# EasyEDA Pro project ProPrj_ESP32-S3-ai-chatbot_2025-01-20.epro

# Schematic Schematic1
Board Name: Board1; Create Date: 2025-01-11; Page Name: P1; Project Name: esp32-s3-wroom-1拓展版; Schematic Name: Schematic1; Update Date: 2025-01-20; Company: 嘉立创EDA; Page Size: A3; Version: V1.0
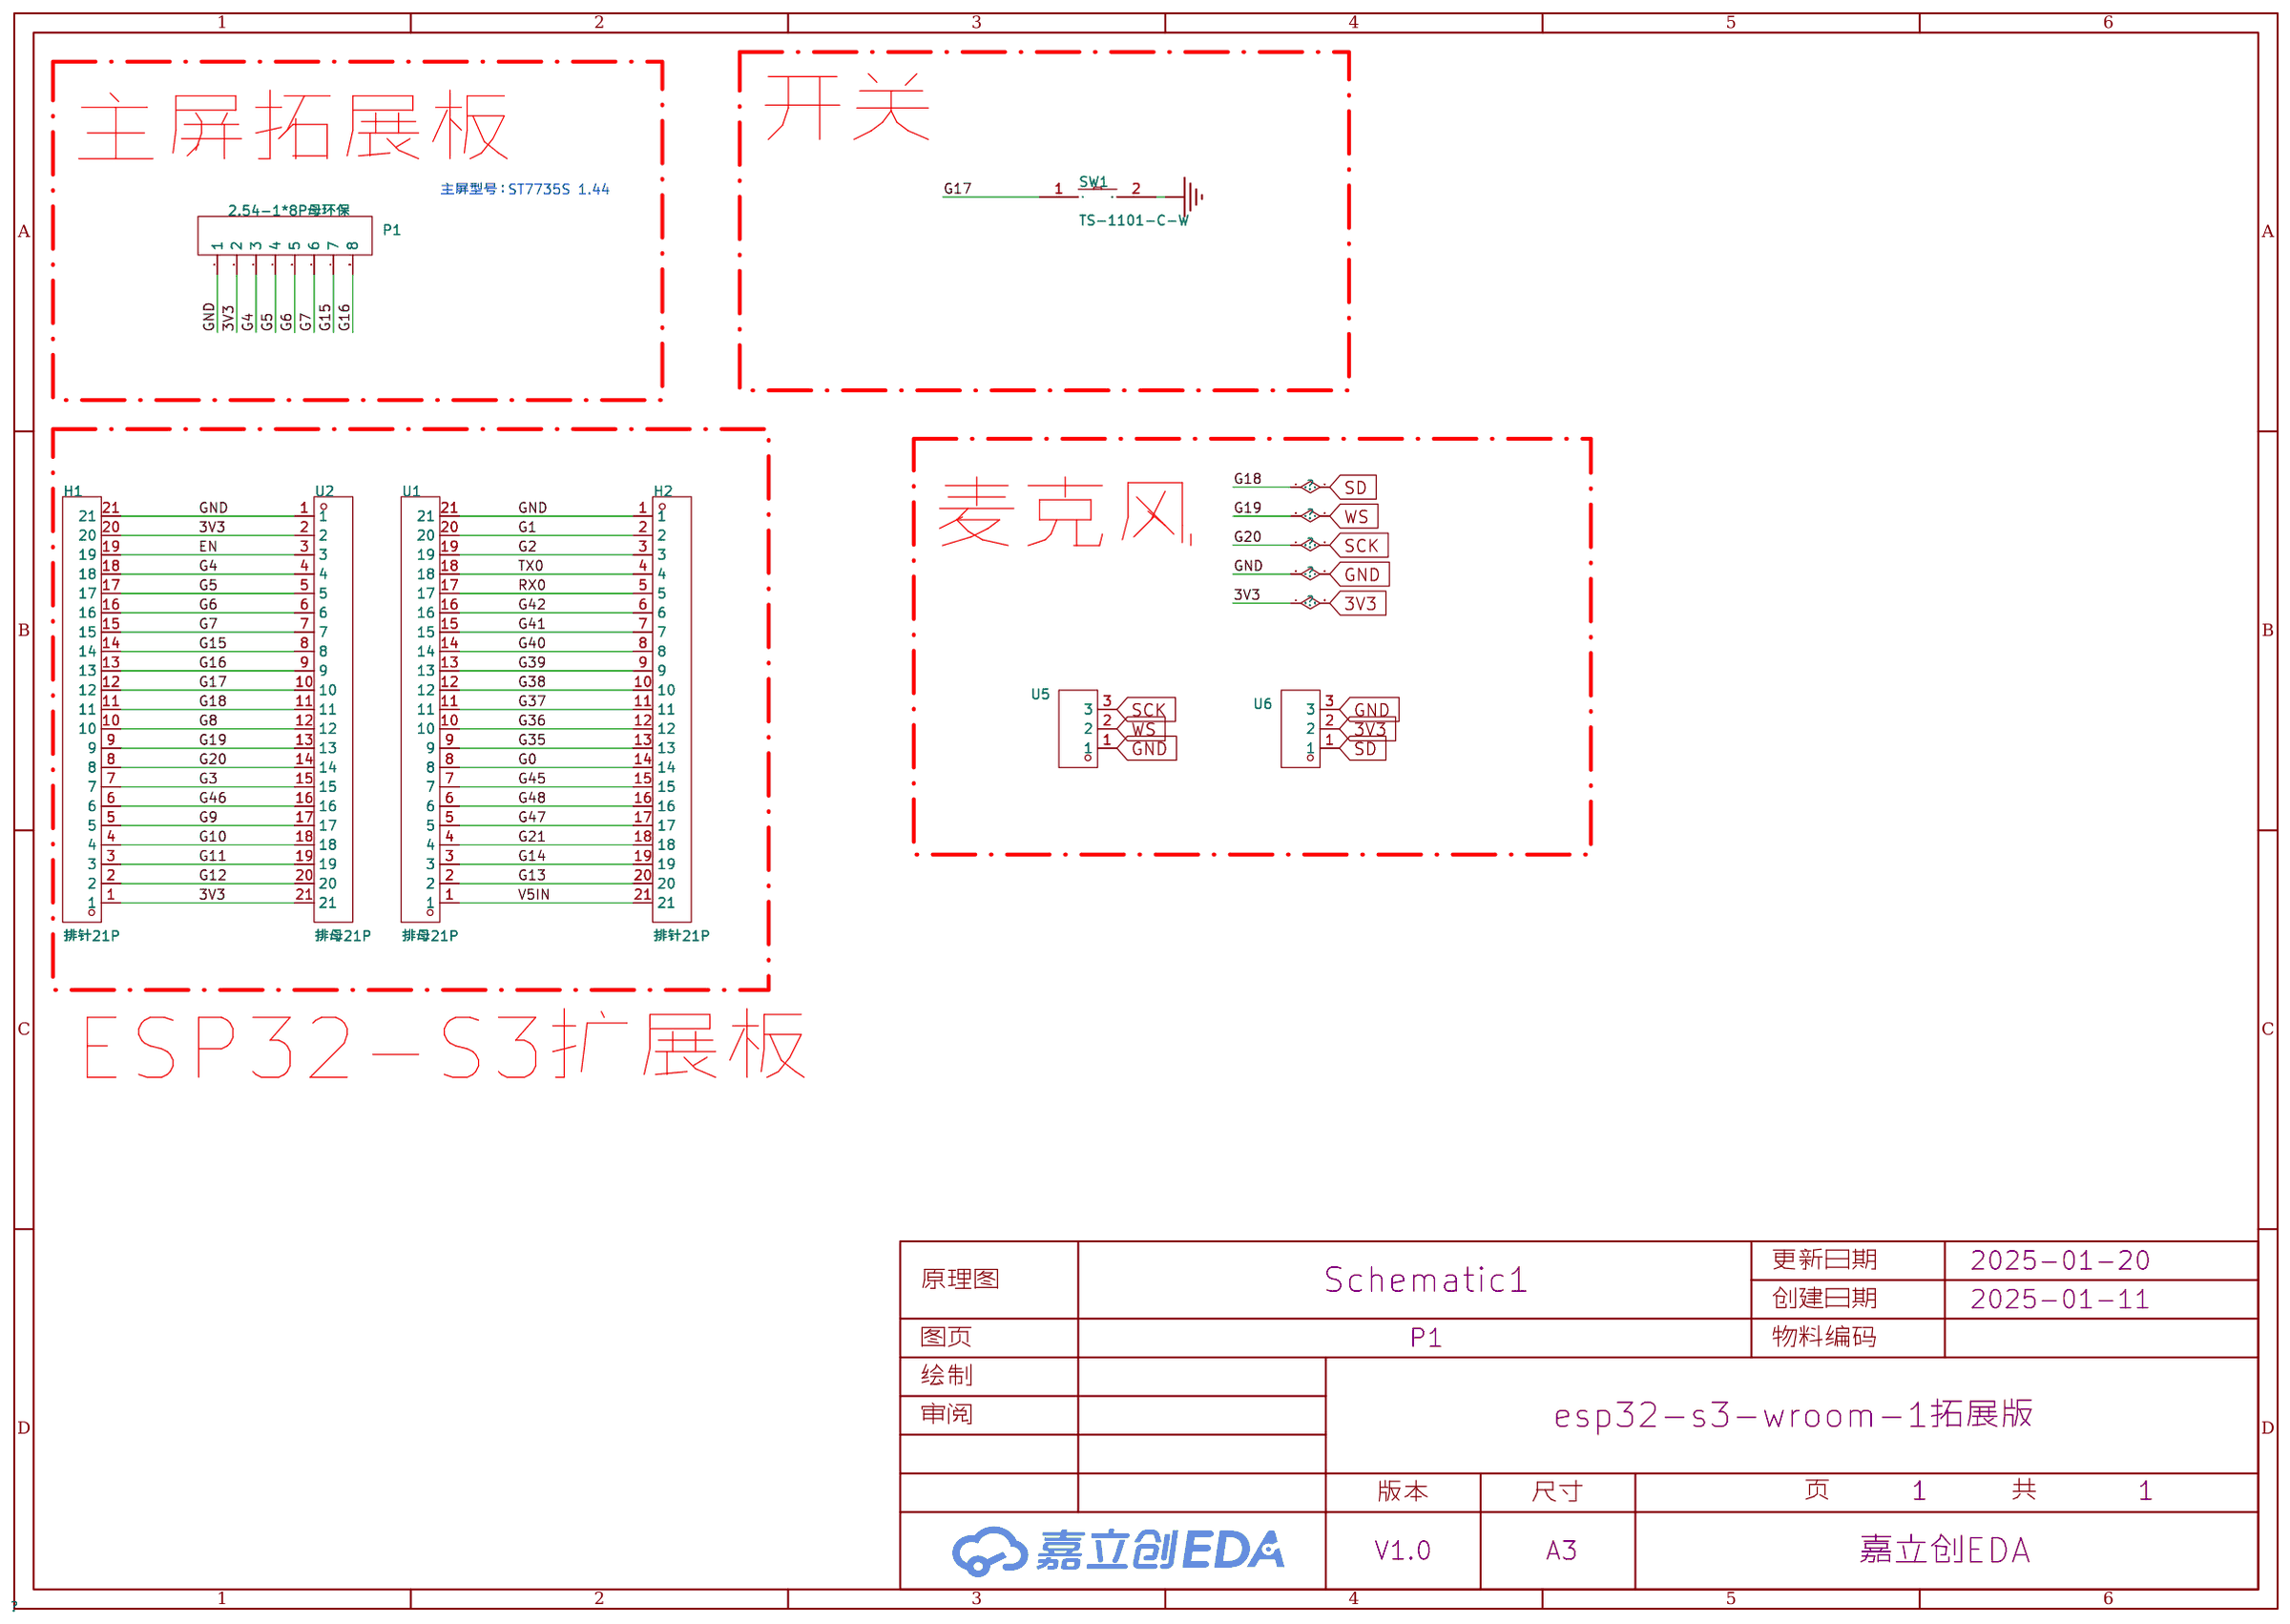
[diagram p0: schematic sheet]

## Parts
H1  排针21P  [HDR-TH_21P-P2.54-V-M]
H2  排针21P  [HDR-TH_21P-P2.54-V-M]
P1  2.54-1*8P母环保  [HDR-TH_8P-P2.54-V-F-1]
SW1  TS-1101-C-W  [SW-SMD_L6.0-W3.3-LS8.0]
U1  排母21P  [HDR-TH_21P-P2.54-V-F]
U2  排母21P  [HDR-TH_21P-P2.54-V-F]
U5  排母2.54mm 1X3pin  [HDR-TH_3P-P2.54_CS-1165SDIG]
U6  排母2.54mm 1X3pin  [HDR-TH_3P-P2.54_CS-1165SDIG]

## Library data of the parts
H1 H2 = X6511WV-21H-C60D30: 插针结构:1x21P;间距:2.54mm;行距:2.54mm;圆针/方针:方针;安装类型:-;排数:单排;总PIN位数:21P;额定电流:3A;额定电压:250V;配合针长度:-;塑高:2.5mm;端接针长度:-;触头材质:黄铜;触头镀层:金;工作温度范围:-40℃~+105℃;焊接温度(最大值):260℃;颜色:黑色;; LCSC Part Name: 1x21P 间距:2.54mm 方针; Supplier Part: C725953; Manufacturer: XKB Connection(中国星坤); Supplier Footprint: 插件,P=2.54mm; JLCPCB Part Class: 扩展库; Supplier: LCSC; Pin Structure: 1x21P; Pitch: 2.54mm; Row Spacing: 2.54mm; Circluar Pins/Square Pins: 方针; Number of Rows: 单排; Number of Pins: 21P; Current Rating (Max): 3A; Voltage Rating (Max): 250V; Insulation Height: 2.5mm; Contact Material: 黄铜; Contact Plating: 金; Operating Temperature Range: -40℃~+105℃; Soldering Temperature(Max): 260℃; Color: 黑色
P1 = 2.54-1*8P母环保: 插孔结构:1x8P;间距:2.54mm;行距:-;安装类型:直插;排数:单排;总孔位数:8P;塑高:-;触头材质:-;触头镀层:-;; LCSC Part Name: 间距:2.54mm 1x8P 直插; Supplier Part: C27438; Manufacturer: BOOMELE(博穆精密); Supplier Footprint: 插件,P=2.54mm; JLCPCB Part Class: 扩展库; Datasheet: https://atta.szlcsc.com/upload/public/pdf/source/20231221/1CA800C6799ED97958773716FAA1BFFE.pdf; Supplier: LCSC; Holes Structure: 1x8P; Pitch: 2.54mm; Mounting Type: 直插; Number of Rows: 单排; Number of Holes: 8P
SW1 = TS-1101-C-W: 电路结构:单刀单掷;按钮形状:矩形按钮;作用力:260gf;安装方式:立贴;开关长度:6mm;开关宽度:3.6mm;开关高度:2.5mm;带支架:不带;触点电流:50mA;额定电压(AC):-;额定电压(DC):12V;额定功率:-;绝缘电阻:-;带灯:无;机械寿命:5万次;; LCSC Part Name: 6*3.6*2.5mm 立贴 轻触开关; Supplier Part: C318938; Manufacturer: XKB Connectivity(中国星坤); Supplier Footprint: SMD; JLCPCB Part Class: 扩展库; Datasheet: https://atta.szlcsc.com/upload/public/pdf/source/20200227/C318938_C2E53B1EEDE37D980A33616AC086DE53.pdf; Supplier: LCSC; Circuit: 单刀单掷; Actuator Style: 矩形按钮; Operating Force: 260gf; Mounting Style: 立贴; Switch Length: 6mm; Switch Width: 3.6mm; Switch Height: 2.5mm; Strike Gundam: 不带; Contact Current: 50mA; Voltage Rating (DC): 12V; Actuator/Cap Color: 白色带淡绿; With Lamp: 无; Mechanical Life: 5万次; Operating Temperature: -30℃~+85℃
U1 U2 = X6511FV-21-C85D32: 插孔结构:1x21P;间距:2.54mm;行距:-;圆孔/方孔:方孔;安装类型:直插;排数:单排;总孔位数:21P;额定电流:3A;额定电压:250V;插孔方向:顶部;塑高:8.5mm;触头材质:黄铜;触头镀层:金;工作温度范围:-40℃~+105℃;焊接温度(最大值):260℃;; LCSC Part Name: 间距:2.54mm 1x21P 直插; Supplier Part: C2883738; Manufacturer: XKB Connection(中国星坤); Supplier Footprint: 插件,P=2.54mm; JLCPCB Part Class: 扩展库; Datasheet: https://atta.szlcsc.com/upload/public/pdf/source/20211009/E31A179D77B4765F9C2936200B697B47.pdf; Supplier: LCSC; Holes Structure: 1x21P; Pitch: 2.54mm; Circular Hole / Square Hole: 方孔; Mounting Type: 直插; Number of Rows: 单排; Number of Holes: 21P; Current Rating (Max): 3A; Voltage Rating (Max): 250V; Holes Direction: 顶部; Insulation Height: 8.5mm; Contact Material: 黄铜; Contact Plating: 金; Operating Temperature Range: -40℃~+105℃; Soldering Temperature(Max): 260℃
U5 U6 = 排母2.54mm 1X3pin: Supplier Part: C9900016709; JLCPCB Part Class: 扩展库; Supplier: LCSC

## Nets
3V3: H1.1 H1.20 P1.2 U2.2 U2.21 U6.2
GND: H1.21 H2.1 P1.1 SW1.2 U1.21 U2.1 U5.1 U6.3
V5IN: H2.21 U1.1
EN: H1.19 U2.3
G0: H2.14 U1.8
G1: H2.2 U1.20
G2: H2.3 U1.19
G3: H1.7 U2.15
G4: H1.18 P1.3 U2.4
G5: H1.17 P1.4 U2.5
G6: H1.16 P1.5 U2.6
G7: H1.15 P1.6 U2.7
G8: H1.10 U2.12
G9: H1.5 U2.17
G10: H1.4 U2.18
G11: H1.3 U2.19
G12: H1.2 U2.20
G13: H2.20 U1.2
G14: H2.19 U1.3
G15: H1.14 P1.7 U2.8
G16: H1.13 P1.8 U2.9
G17: H1.12 SW1.1 U2.10
G18: H1.11 U2.11 U6.1
G19: H1.9 U2.13 U5.2
G20: H1.8 U2.14 U5.3
G21: H2.18 U1.4
G35: H2.13 U1.9
G36: H2.12 U1.10
G37: H2.11 U1.11
G38: H2.10 U1.12
G39: H2.9 U1.13
G40: H2.8 U1.14
G41: H2.7 U1.15
G42: H2.6 U1.16
G45: H2.15 U1.7
G46: H1.6 U2.16
G47: H2.17 U1.5
G48: H2.16 U1.6
RX0: H2.5 U1.17
TX0: H2.4 U1.18

## Notes on the sheet
- 开关
- 主屏拓展板
- 主屏型号：ST7735S 1.44
- 麦克风
- ESP32-S3扩展板

# Board PCB
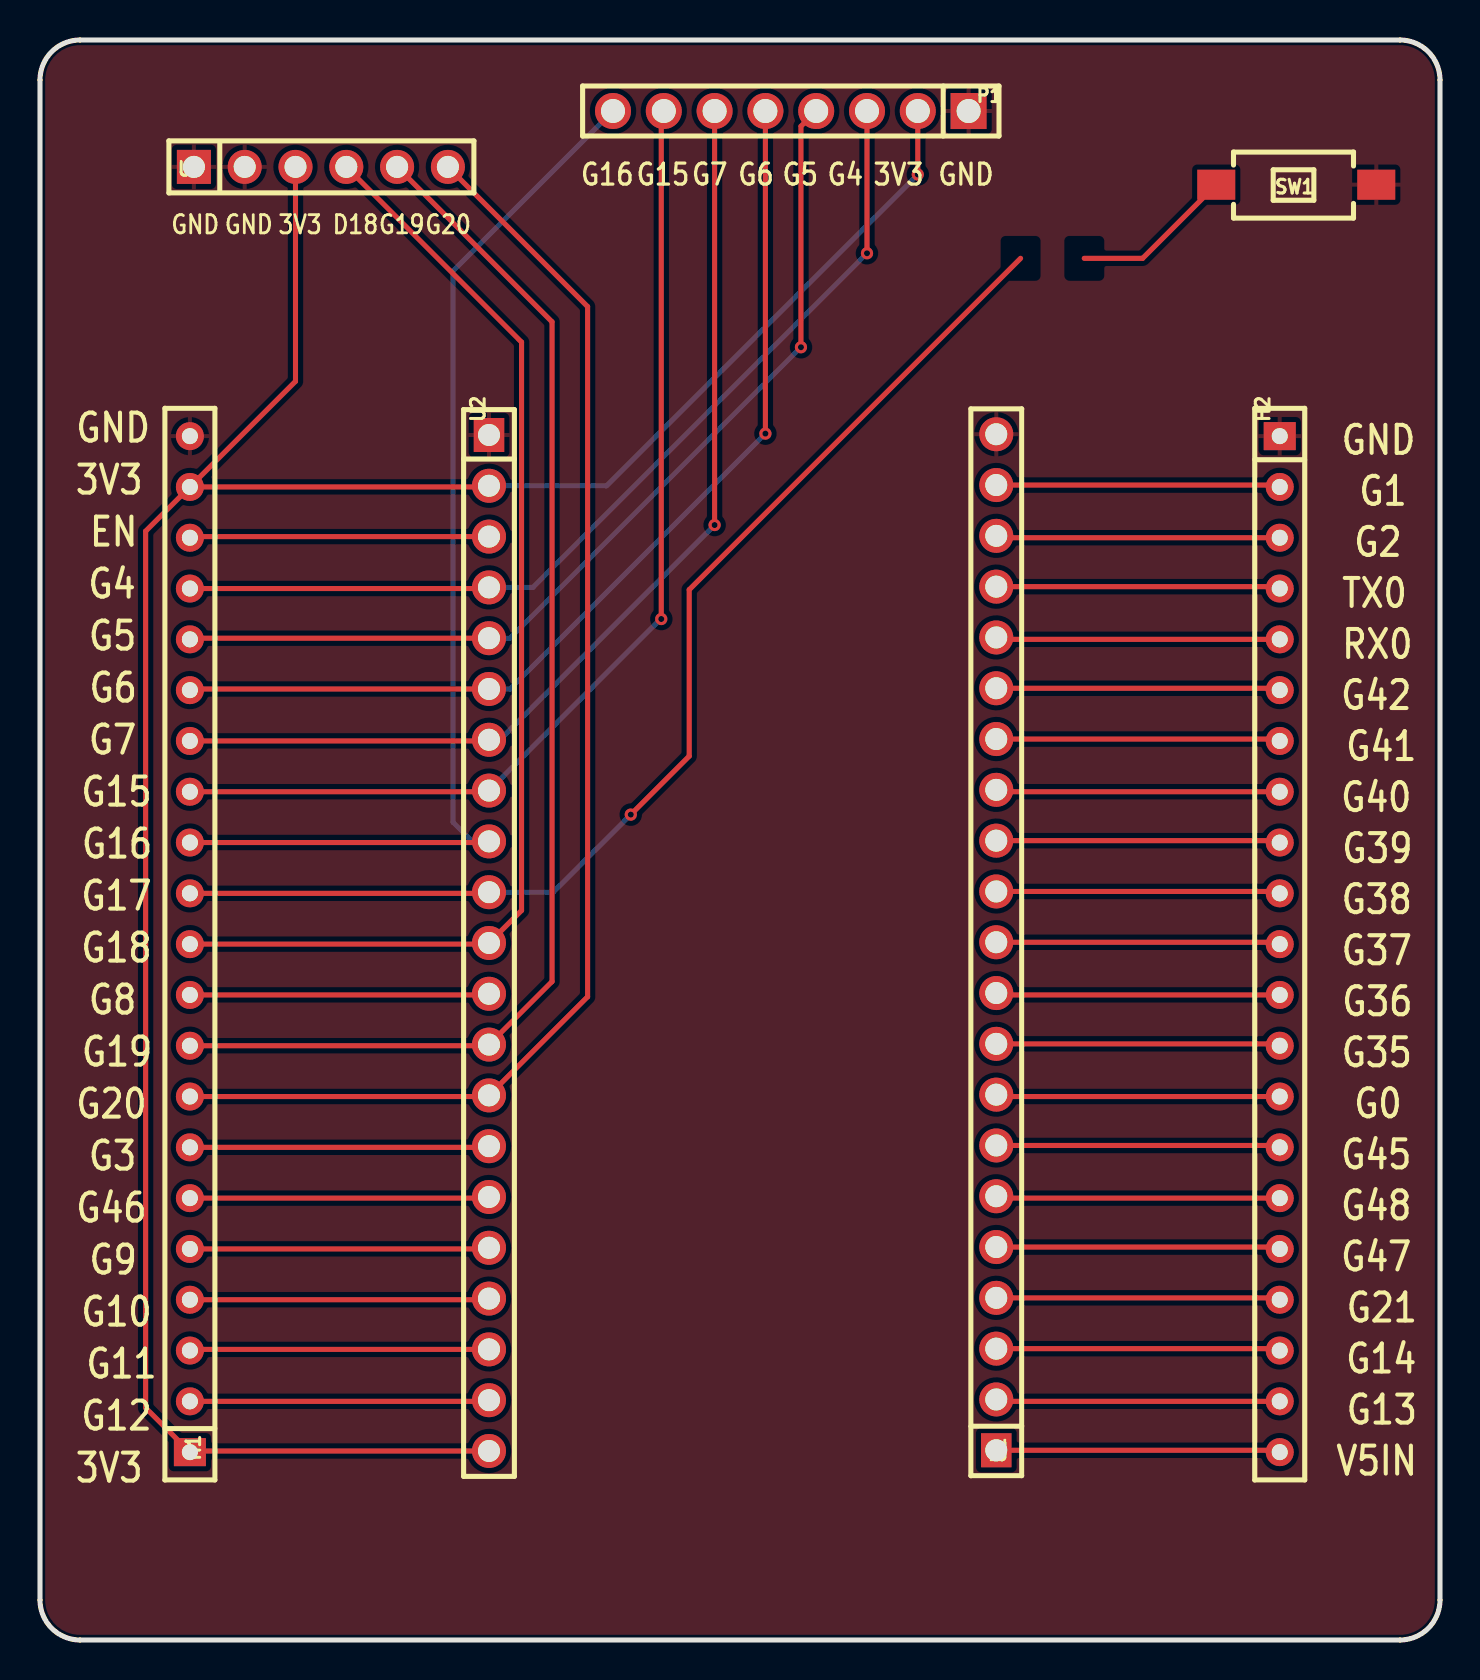
[diagram p1: board, top side]
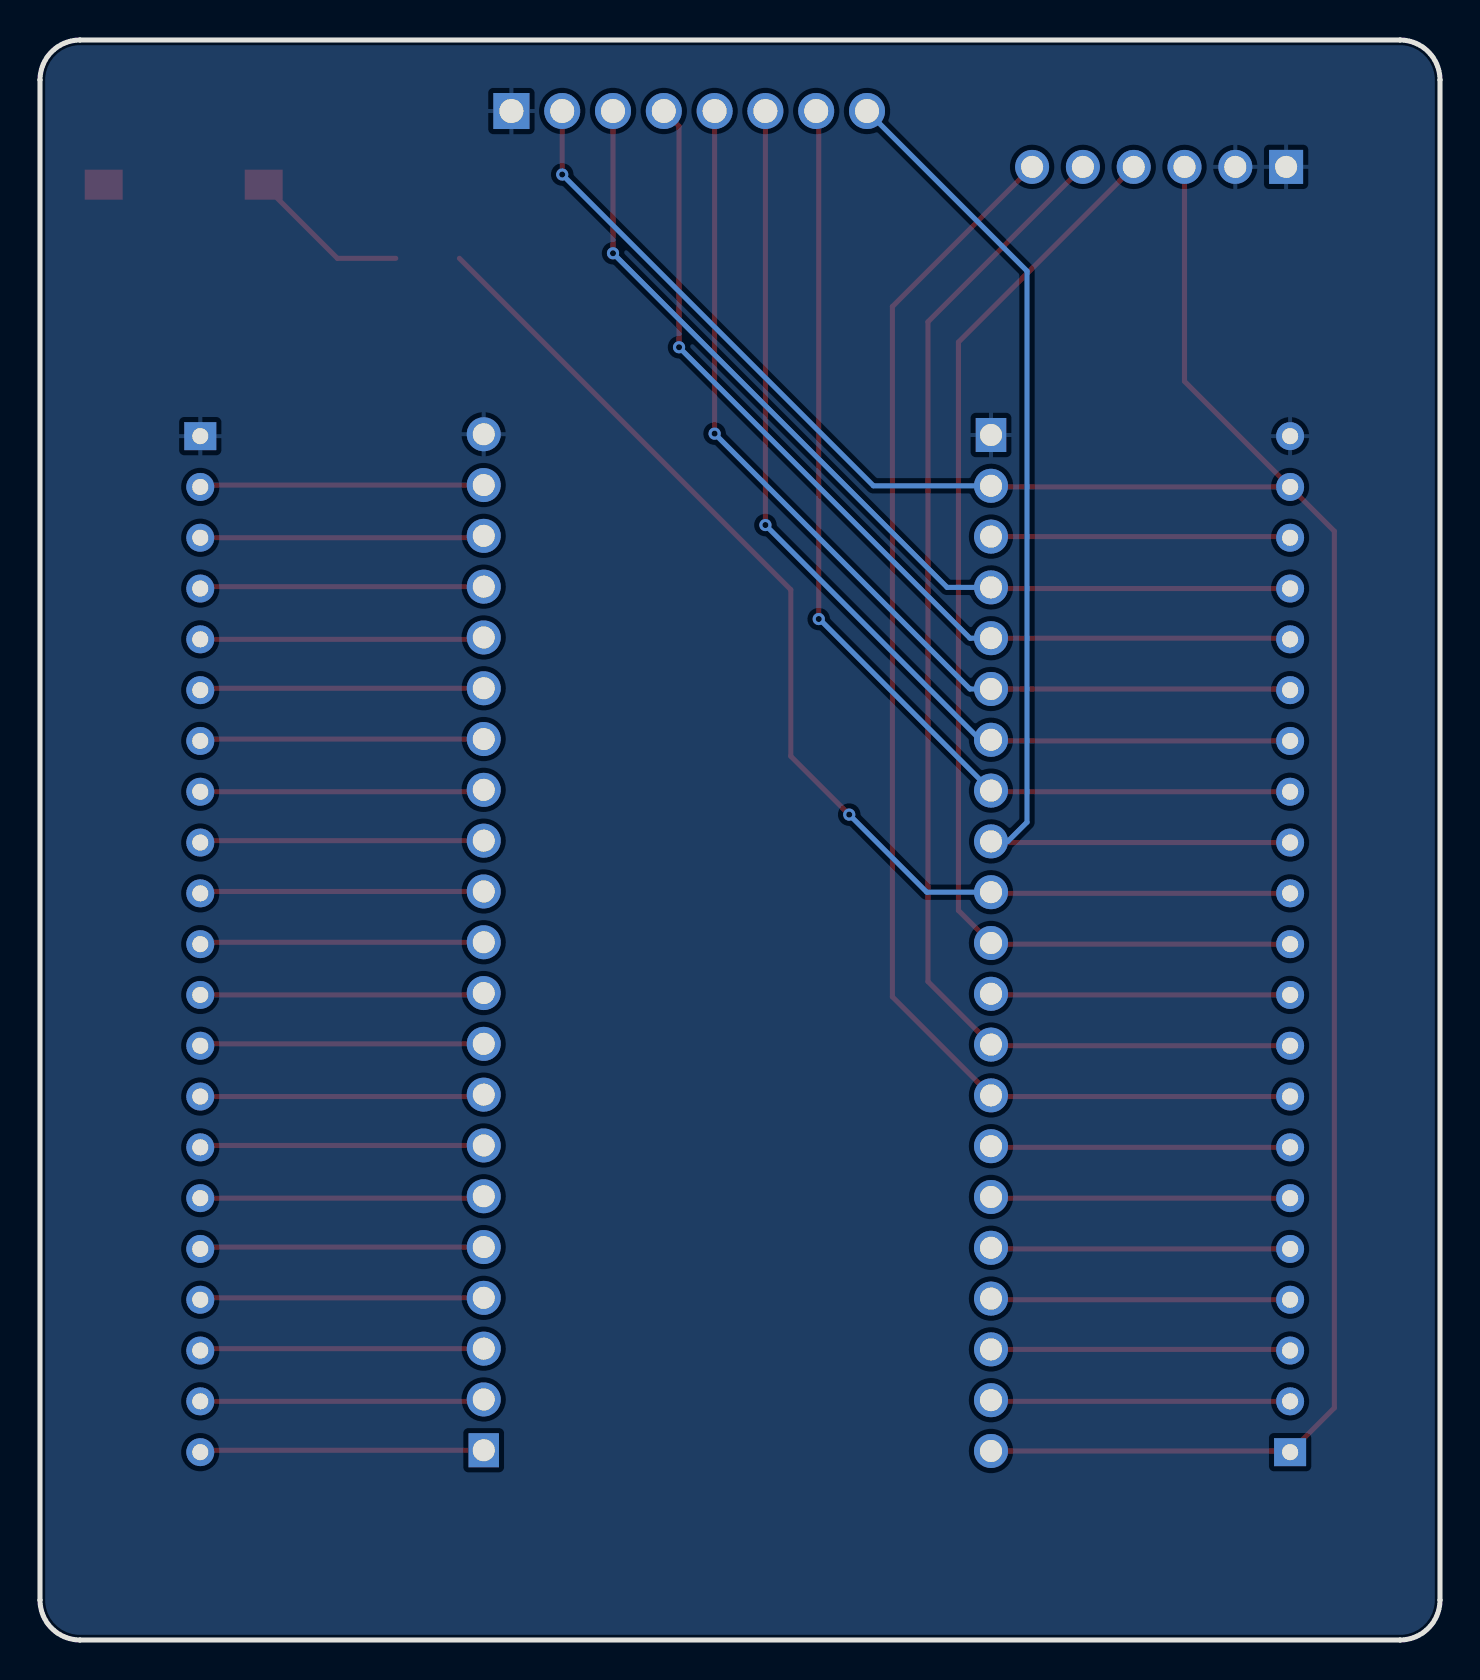
[diagram p2: board, bottom side, seen from below]

Outline 70 x 80 mm; copper layers: Top Layer, Bottom Layer. Coordinates in mm from the lower left corner of the outline.
Outline path: 0,78 0,2 arc(0.59,0.59) 2,0 68,0 arc(69.41,0.59) 70,2 70,78 arc(69.41,79.41) 68,80 2,80 arc(0.59,79.41) 0,78
Stack: Top Layer 0.035mm / Dielectric1 1.51mm FR4 er 4.5 / Bottom Layer 0.035mm

## Design rules (mm)
template: JLCPCB Capability(Two Layers Board)
spacing copperThickness1oz (default): track to track 0.102, other pairs 0.152 to 0.3
spacing copperThickness2oz: track to track 0.203, other pairs 0.152 to 0.3
track width copperThickness1oz (default): min 0.127, default 0.254, max 2.54
track width copperThickness2oz: min 0.203, default 0.254, max 2.54
differential pair differentialPair (default): width min 0.127, default 0.254, max 2.54; gap min 0.152, default 0.152
via viaSize (default): diameter min 0.5, default 0.61, max 10; hole min 0.3, default 0.305, max 6.3

## Placement (name value [footprint] x y rotation side)
H1  排针21P  [HDR-TH_21P-P2.54-V-M]  7.49 34.79 90 top
H2  排针21P  [HDR-TH_21P-P2.54-V-M]  61.99 34.79 270 top
P1  2.54-1*8P母环保  [HDR-TH_8P-P2.54-V-F-1]  37.54 76.45 180 top
SW1  TS-1101-C-W  [SW-SMD_L6.0-W3.3-LS8.0]  62.81 72.77 0 top
U1  排母21P  [HDR-TH_21P-P2.54-V-F]  47.81 34.89 90 top
U2  排母21P  [HDR-TH_21P-P2.54-V-F]  22.45 34.85 270 top
U3  2.54-1*6  [HDR-TH_6P-P2.54-V-M]  14.04 73.66 0 top

## Footprints (pads in the part's own frame, mm; a bottom-side part is the same pattern mirrored in y, then rotated)
HDR-TH_6P-P2.54-V-M
  rect 1.7x1.7 hole 1.1: 1(-6.35,0)
  round 1.7 hole 1.1: 2(-3.81,0) 3(-1.27,0) 4(1.27,0) 5(3.81,0) 6(6.35,0)
HDR-TH_8P-P2.54-V-F-1
  rect 1.8x1.8 hole 1.2: 1(-8.89,0)
  round 1.8 hole 1.2: 2(-6.35,0) 3(-3.81,0) 4(-1.27,0) 5(1.27,0) 6(3.81,0) 7(6.35,0) 8(8.89,0)
HDR-TH_21P-P2.54-V-F
  rect 1.7x1.524 hole 1.1: 1(-25.4,0)
  round 1.7 hole 1.1: 2(-22.86,0) 3(-20.32,0) 4(-17.78,0) 5(-15.24,0) 6(-12.7,0) 7(-10.16,0) 8(-7.62,0) 9(-5.08,0) 10(-2.54,0) 11(0,0) 12(2.54,0) 13(5.08,0) 14(7.62,0) 15(10.16,0) 16(12.7,0) 17(15.24,0) 18(17.78,0) 19(20.32,0) 20(22.86,0) 21(25.4,0)
HDR-TH_21P-P2.54-V-M
  rect 1.4x1.6 hole 0.8: 1(-25.4,0)
  round 1.4 hole 0.8: 2(-22.86,0) 3(-20.32,0) 4(-17.78,0) 5(-15.24,0) 6(-12.7,0) 7(-10.16,0) 8(-7.62,0) 9(-5.08,0) 10(-2.54,0) 11(0,0) 12(2.54,0) 13(5.08,0) 14(7.62,0) 15(10.16,0) 16(12.7,0) 17(15.24,0) 18(17.78,0) 19(20.32,0) 20(22.86,0) 21(25.4,0)
SW-SMD_L6.0-W3.3-LS8.0
  rect 1.9x1.5 smd: 1(-4,0) 2(4,0)

## Nets
3V3: H1.1 H1.20 P1.2 U2.2 U2.21 U3.3
GND: H1.21 H2.1 P1.1 SW1.2 U1.21 U2.1 U3.1 U3.2
V5IN: H2.21 U1.1
DO: H1.11 U2.11 U3.4
EN: H1.19 U2.3
G0: H2.14 U1.8
G1: H2.2 U1.20
G2: H2.3 U1.19
G3: H1.7 U2.15
G4: H1.18 P1.3 U2.4
G5: H1.17 P1.4 U2.5
G6: H1.16 P1.5 U2.6
G7: H1.15 P1.6 U2.7
G8: H1.10 U2.12
G9: H1.5 U2.17
G10: H1.4 U2.18
G11: H1.3 U2.19
G12: H1.2 U2.20
G13: H2.20 U1.2
G14: H2.19 U1.3
G15: H1.14 P1.7 U2.8
G16: H1.13 P1.8 U2.9
G17: H1.12 SW1.1 U2.10
G19: H1.9 U2.13 U3.5
G20: H1.8 U2.14 U3.6
G21: H2.18 U1.4
G35: H2.13 U1.9
G36: H2.12 U1.10
G37: H2.11 U1.11
G38: H2.10 U1.12
G39: H2.9 U1.13
G40: H2.8 U1.14
G41: H2.7 U1.15
G42: H2.6 U1.16
G45: H2.15 U1.7
G46: H1.6 U2.16
G47: H2.17 U1.5
G48: H2.16 U1.6
RX0: H2.5 U1.17
TX0: H2.4 U1.18

## Via types
v1: diameter 0.61, hole 0.305, Top Layer to Bottom Layer, 7 vias

## Routing (per net, layer and track width the routed paths; a pad name or vN(x,y) marks a point on that pad's centre or on a via; arc(x,y) is an arc through that point)
3V3: length 129.3
  Top Layer w0.254: H1.20 22.39,57.65 U2.2 ; H1.20 12.78,62.93 12.78,73.66 ; H1.20 5.28,55.44 5.28,11.61 H1.1 7.55,9.45 U2.21 ; P1.2 v1(43.89,73.27)
  Bottom Layer w0.254: U2.2 28.33,57.71 v1(43.89,73.27)
V5IN: length 14.2
  Top Layer w0.254: U1.1 61.89,9.49 H2.21
DO: length 58.1
  Top Layer w0.254: U3.4 24.08,64.89 24.08,36.48 U2.11 22.39,34.79 H1.11
EN: length 15
  Top Layer w0.254: H1.19 7.55,55.17 U2.3
G0: length 14.2
  Top Layer w0.254: U1.8 47.91,27.17 H2.14
G1: length 14.2
  Top Layer w0.254: U1.20 61.89,57.75 H2.2
G2: length 14.2
  Top Layer w0.254: U1.19 47.91,55.11 H2.3
G3: length 15
  Top Layer w0.254: U2.15 22.39,24.63 7.49,24.63
G4: length 47.9
  Top Layer w0.254: 7.49,52.57 22.39,52.57 U2.4 ; P1.3 v1(41.35,69.34)
  Bottom Layer w0.254: U2.4 24.64,52.63 v1(41.35,69.34)
G5: length 48.7
  Top Layer w0.254: v1(38.05,64.64) 38.05,75.69 P1.4 ; U2.5 7.55,50.09 H1.17
  Bottom Layer w0.254: v1(38.05,64.64) 23.5,50.09 U2.5
G6: length 50.2
  Top Layer w0.254: U2.6 7.55,47.55 7.49,47.49 ; P1.5 v1(36.27,60.32)
  Bottom Layer w0.254: U2.6 23.5,47.55 v1(36.27,60.32)
G7: length 51.4
  Top Layer w0.254: U2.7 22.39,44.95 H1.15 ; P1.6 v1(33.73,55.75)
  Bottom Layer w0.254: U2.7 22.99,45.01 v1(33.73,55.75)
G8: length 15
  Top Layer w0.254: H1.10 22.39,32.25 U2.12
G9: length 15
  Top Layer w0.254: H1.5 22.39,19.55 U2.17
G10: length 15
  Top Layer w0.254: H1.4 22.39,17.01 U2.18
G11: length 15
  Top Layer w0.254: H1.3 7.55,14.53 U2.19
G12: length 15
  Top Layer w0.254: H1.2 22.39,11.93 U2.20
G13: length 14.2
  Top Layer w0.254: U1.2 47.91,11.93 H2.20
G14: length 14.3
  Top Layer w0.254: 61.99,14.31 61.99,14.39 61.81,14.57 U1.3
G15: length 52.6
  Top Layer w0.254: U2.8 22.39,42.41 7.49,42.41 ; v1(31.06,51.05) 31.06,76.32 P1.7
  Bottom Layer w0.254: v1(31.06,51.05) 31.03,51.05 U2.8
G16: length 56.1
  Top Layer w0.254: H1.13 22.39,39.87 U2.9
  Bottom Layer w0.254: U2.9 21.61,39.93 20.65,40.89 20.65,68.45 P1.8
G17: length 67.7
  Top Layer w0.254: 7.49,37.33 22.39,37.33 U2.10 ; SW1.1 55.13,69.08 52.21,69.08 ; 49.03,69.08 32.46,52.51 32.46,44.19 v1(29.54,41.27)
  Bottom Layer w0.254: U2.10 25.66,37.39 v1(29.54,41.27)
G19: length 63.4
  Top Layer w0.254: U3.5 25.6,65.91 25.6,32.92 U2.13 22.39,29.71 7.49,29.71
G20: length 66.3
  Top Layer w0.254: 20.4,73.66 27.38,66.67 27.38,32.16 U2.14 22.39,27.17 H1.8
G21: length 14.2
  Top Layer w0.254: H2.18 61.89,17.11 U1.4
G35: length 14.2
  Top Layer w0.254: U1.9 61.89,29.81 61.99,29.71
G36: length 14.2
  Top Layer w0.254: U1.10 47.91,32.25 H2.12
G37: length 14.2
  Top Layer w0.254: U1.11 61.89,34.89 H2.11
G38: length 14.2
  Top Layer w0.254: U1.12 61.89,37.43 61.99,37.33
G39: length 14.2
  Top Layer w0.254: U1.13 61.89,39.97 H2.9
G40: length 14.2
  Top Layer w0.254: 61.99,42.41 47.91,42.41 U1.14
G41: length 14.2
  Top Layer w0.254: U1.15 61.89,45.05 H2.7
G42: length 14.2
  Top Layer w0.254: U1.16 61.89,47.59 61.99,47.49
G45: length 14.2
  Top Layer w0.254: 61.99,24.63 61.89,24.73 U1.7
G46: length 15
  Top Layer w0.254: U2.16 22.39,22.09 H1.6
G47: length 14.2
  Top Layer w0.254: H2.17 61.89,19.65 U1.5
G48: length 14.2
  Top Layer w0.254: U1.6 47.91,22.09 H2.16
RX0: length 14.2
  Top Layer w0.254: H2.5 47.91,50.03 U1.17
TX0: length 14.2
  Top Layer w0.254: 61.99,52.57 61.89,52.67 U1.18

## Copper pours and planes (outline as drawn; the poured copper is in the pictures)
GND on Top Layer: -7.67,100.83 83.13,100.83 83.13,-19.06 -7.67,-19.06
GND on Bottom Layer: -39.8,92.58 106.25,92.58 106.25,-6.23 -39.8,-6.23

## Text on the board
Top Silkscreen Layer: GND | 3V3 | D18 | G19 | G20 | G16 | G15 | G7 | G6 | G5 | G4 | G46 | G17 | G18 | G10 | G12 | G11 | G8 | G3 | G9 | EN | V5IN | G42 | G40 | G45 | G48 | G47 | G38 | G37 | G35 | TX0 | RX0 | G39 | G36 | G41 | G14 | G21 | G13 | G2 | G0 | G1

# Board ME
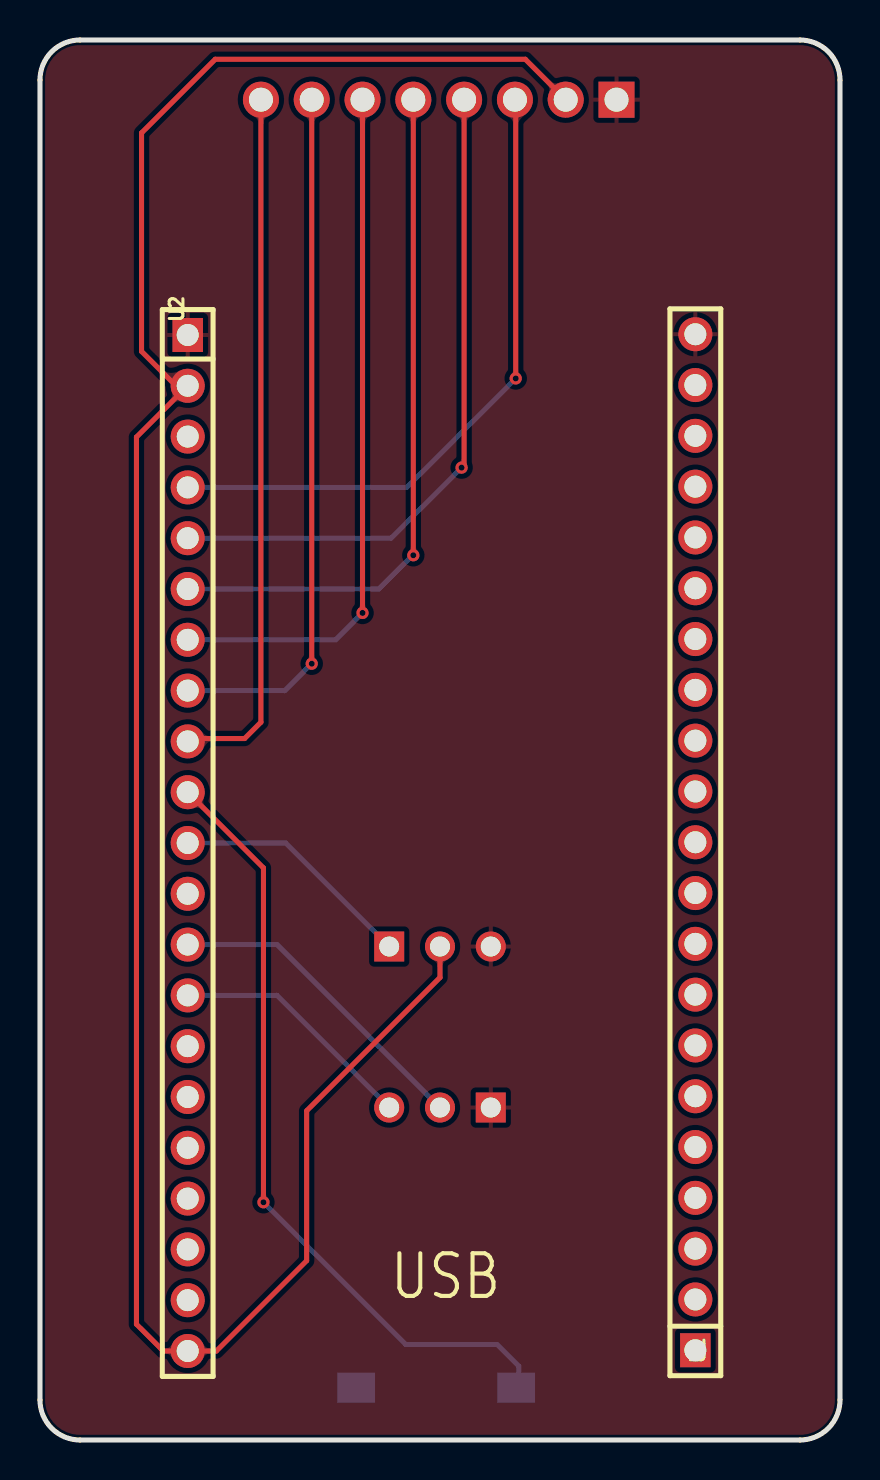
[diagram p3: board, top side]
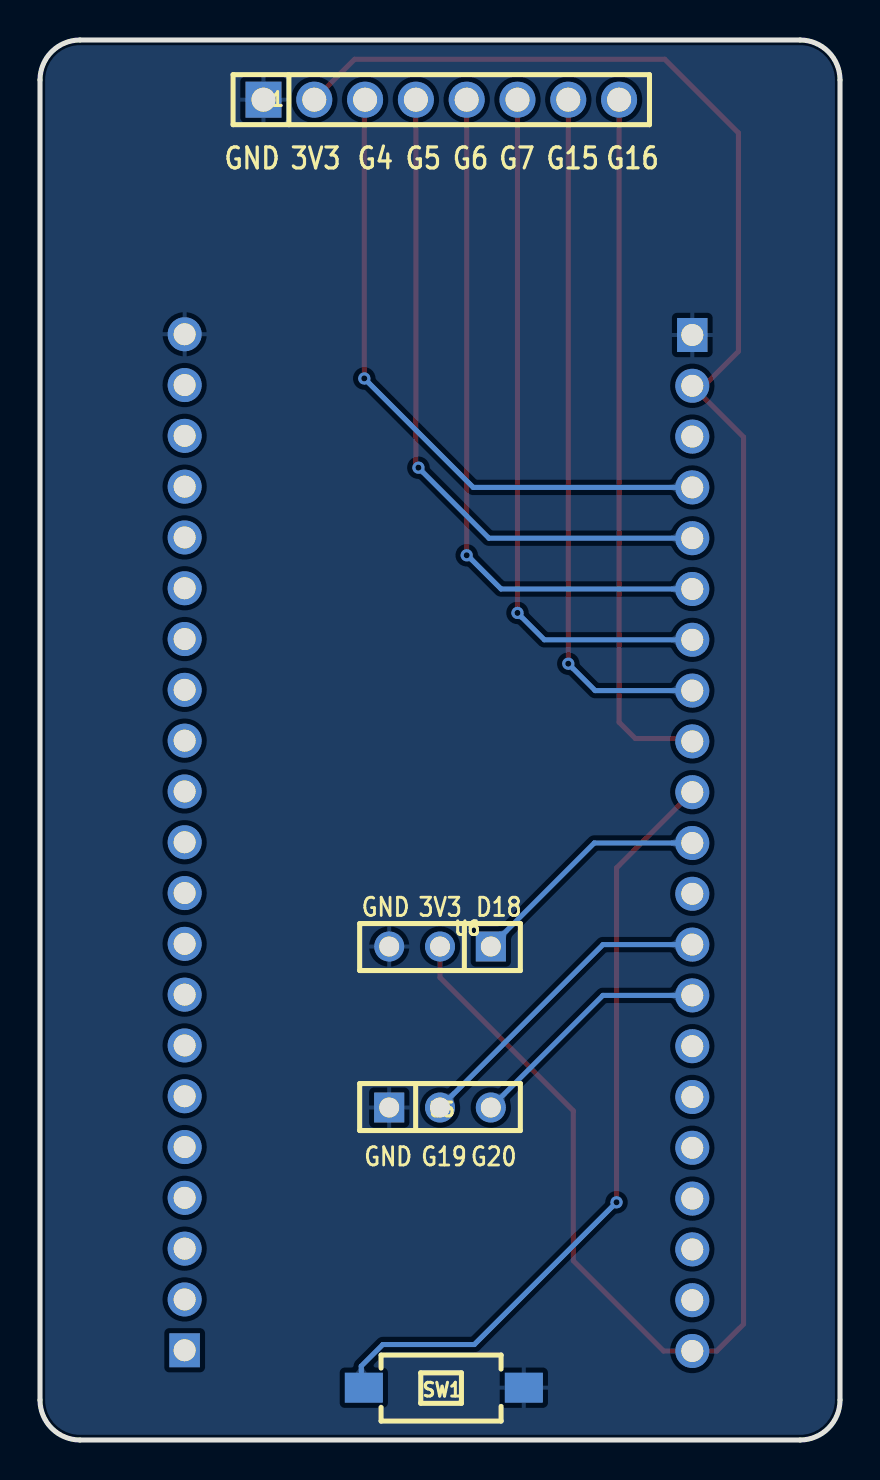
[diagram p4: board, bottom side, seen from below]

Outline 40 x 70 mm; copper layers: Top Layer, Bottom Layer. Coordinates in mm from the lower left corner of the outline.
Outline path: 0,68 0,2 arc(0.59,0.59) 2,0 38,0 arc(39.41,0.59) 40,2 40,68 arc(39.41,69.41) 38,70 2,70 arc(0.59,69.41) 0,68
Stack: Top Layer 0.035mm / Dielectric1 1.51mm FR4 er 4.5 / Bottom Layer 0.035mm

## Design rules (mm)
template: JLCPCB Capability(Two Layers Board)
spacing copperThickness1oz (default): track to track 0.102, other pairs 0.152 to 0.3
spacing copperThickness2oz: track to track 0.203, other pairs 0.152 to 0.3
track width copperThickness1oz (default): min 0.127, default 0.254, max 2.54
track width copperThickness2oz: min 0.203, default 0.254, max 2.54
differential pair differentialPair (default): width min 0.127, default 0.254, max 2.54; gap min 0.152, default 0.152
via viaSize (default): diameter min 0.5, default 0.61, max 10; hole min 0.3, default 0.305, max 6.3

## Placement (name value [footprint] x y rotation side)
P1  2.54-1*8P母环保  [HDR-TH_8P-P2.54-V-F-1]  19.94 67.02 180 bottom
SW1  TS-1101-C-W  [SW-SMD_L6.0-W3.3-LS8.0]  19.81 2.62 180 bottom
U1  排母21P  [HDR-TH_21P-P2.54-V-F]  32.77 29.89 90 top
U2  排母21P  [HDR-TH_21P-P2.54-V-F]  7.39 29.85 270 top
U5  排母2.54mm 1X3pin  [HDR-TH_3P-P2.54_CS-1165SDIG]  20 16.62 180 bottom
U6  排母2.54mm 1X3pin  [HDR-TH_3P-P2.54_CS-1165SDIG]  20 24.67 0 bottom

## Footprints (pads in the part's own frame, mm; a bottom-side part is the same pattern mirrored in y, then rotated)
HDR-TH_3P-P2.54_CS-1165SDIG
  rect 1.5x1.5 hole 1: 1(-2.54,0)
  round 1.5 hole 1: 2(0,0) 3(2.54,0)
HDR-TH_8P-P2.54-V-F-1
  rect 1.8x1.8 hole 1.2: 1(-8.89,0)
  round 1.8 hole 1.2: 2(-6.35,0) 3(-3.81,0) 4(-1.27,0) 5(1.27,0) 6(3.81,0) 7(6.35,0) 8(8.89,0)
HDR-TH_21P-P2.54-V-F
  rect 1.7x1.524 hole 1.1: 1(-25.4,0)
  round 1.7 hole 1.1: 2(-22.86,0) 3(-20.32,0) 4(-17.78,0) 5(-15.24,0) 6(-12.7,0) 7(-10.16,0) 8(-7.62,0) 9(-5.08,0) 10(-2.54,0) 11(0,0) 12(2.54,0) 13(5.08,0) 14(7.62,0) 15(10.16,0) 16(12.7,0) 17(15.24,0) 18(17.78,0) 19(20.32,0) 20(22.86,0) 21(25.4,0)
SW-SMD_L6.0-W3.3-LS8.0
  rect 1.9x1.5 smd: 1(-4,0) 2(4,0)

## Nets
As in the schematic.

## Via types
v1: diameter 0.61, hole 0.305, Top Layer to Bottom Layer, 6 vias

## Routing (per net, layer and track width the routed paths; a pad name or vN(x,y) marks a point on that pad's centre or on a via; arc(x,y) is an arc through that point)
3V3: length 114.9
  Top Layer w0.254: U6.2 20,23.13 13.33,16.46 13.33,8.97 8.82,4.45 U2.21 6.16,4.45 4.82,5.79 4.82,50.15 U2.2 6.8,52.71 5.08,54.43 5.08,65.35 8.76,69.04 24.27,69.04 P1.2
G4: length 32.7
  Top Layer w0.254: P1.3 23.83,67.02 23.79,66.97 v1(23.79,53.08)
  Bottom Layer w0.254: v1(23.79,53.08) 18.34,47.63 U2.4
G5: length 33.6
  Top Layer w0.254: P1.4 21.21,48.75 v1(21.08,48.62)
  Bottom Layer w0.254: v1(21.08,48.62) 17.55,45.09 U2.5
G6: length 34.7
  Top Layer w0.254: v1(18.67,44.24) P1.5
  Bottom Layer w0.254: 18.63,44.24 16.95,42.55 U2.6
G7: length 35
  Top Layer w0.254: P1.6 v1(16.13,41.35)
  Bottom Layer w0.254: U2.7 14.78,40.01 v1(16.13,41.35)
G15: length 35
  Top Layer w0.254: P1.7 13.59,38.82
  Bottom Layer w0.254: v1(13.59,38.81) 12.24,37.47 U2.8
G16: length 35.2
  Top Layer w0.254: P1.8 11.05,35.89 10.23,35.07 7.53,35.07 U2.9
G17: length 39.4
  Top Layer w0.254: v1(11.17,11.89) 11.17,28.6 U2.10
  Bottom Layer w0.254: v1(11.17,11.89) 18.29,4.77 22.86,4.77 23.94,3.69 23.94,2.74 SW1.1
G18: length 12.2
  Bottom Layer w0.254: U6.1 12.28,29.85 U2.11
G19: length 16
  Bottom Layer w0.254: U5.2 11.85,24.77 U2.13
G20: length 12.4
  Bottom Layer w0.254: U2.14 11.85,22.23 U5.3

## Copper pours and planes (outline as drawn; the poured copper is in the pictures)
GND on Top Layer: -25.91,74.62 65.02,74.62 65.02,-7.29 -25.91,-7.29
GND on Bottom Layer: -7.88,85.16 47.5,85.16 47.5,-12.24 -7.88,-12.24

Small or netless copper shapes (teardrops, artwork), in the pictures only: 20 on Top Layer, 18 on Bottom Layer

## Text on the board
Bottom Silkscreen Layer: 3V3 | D18 | G20 | G19 | GND | G16 | G15 | G7 | G6 | G5 | G4
Top Silkscreen Layer: USB
